# Altium schematic sheet ATMEGA128RF.SchDoc
size A3
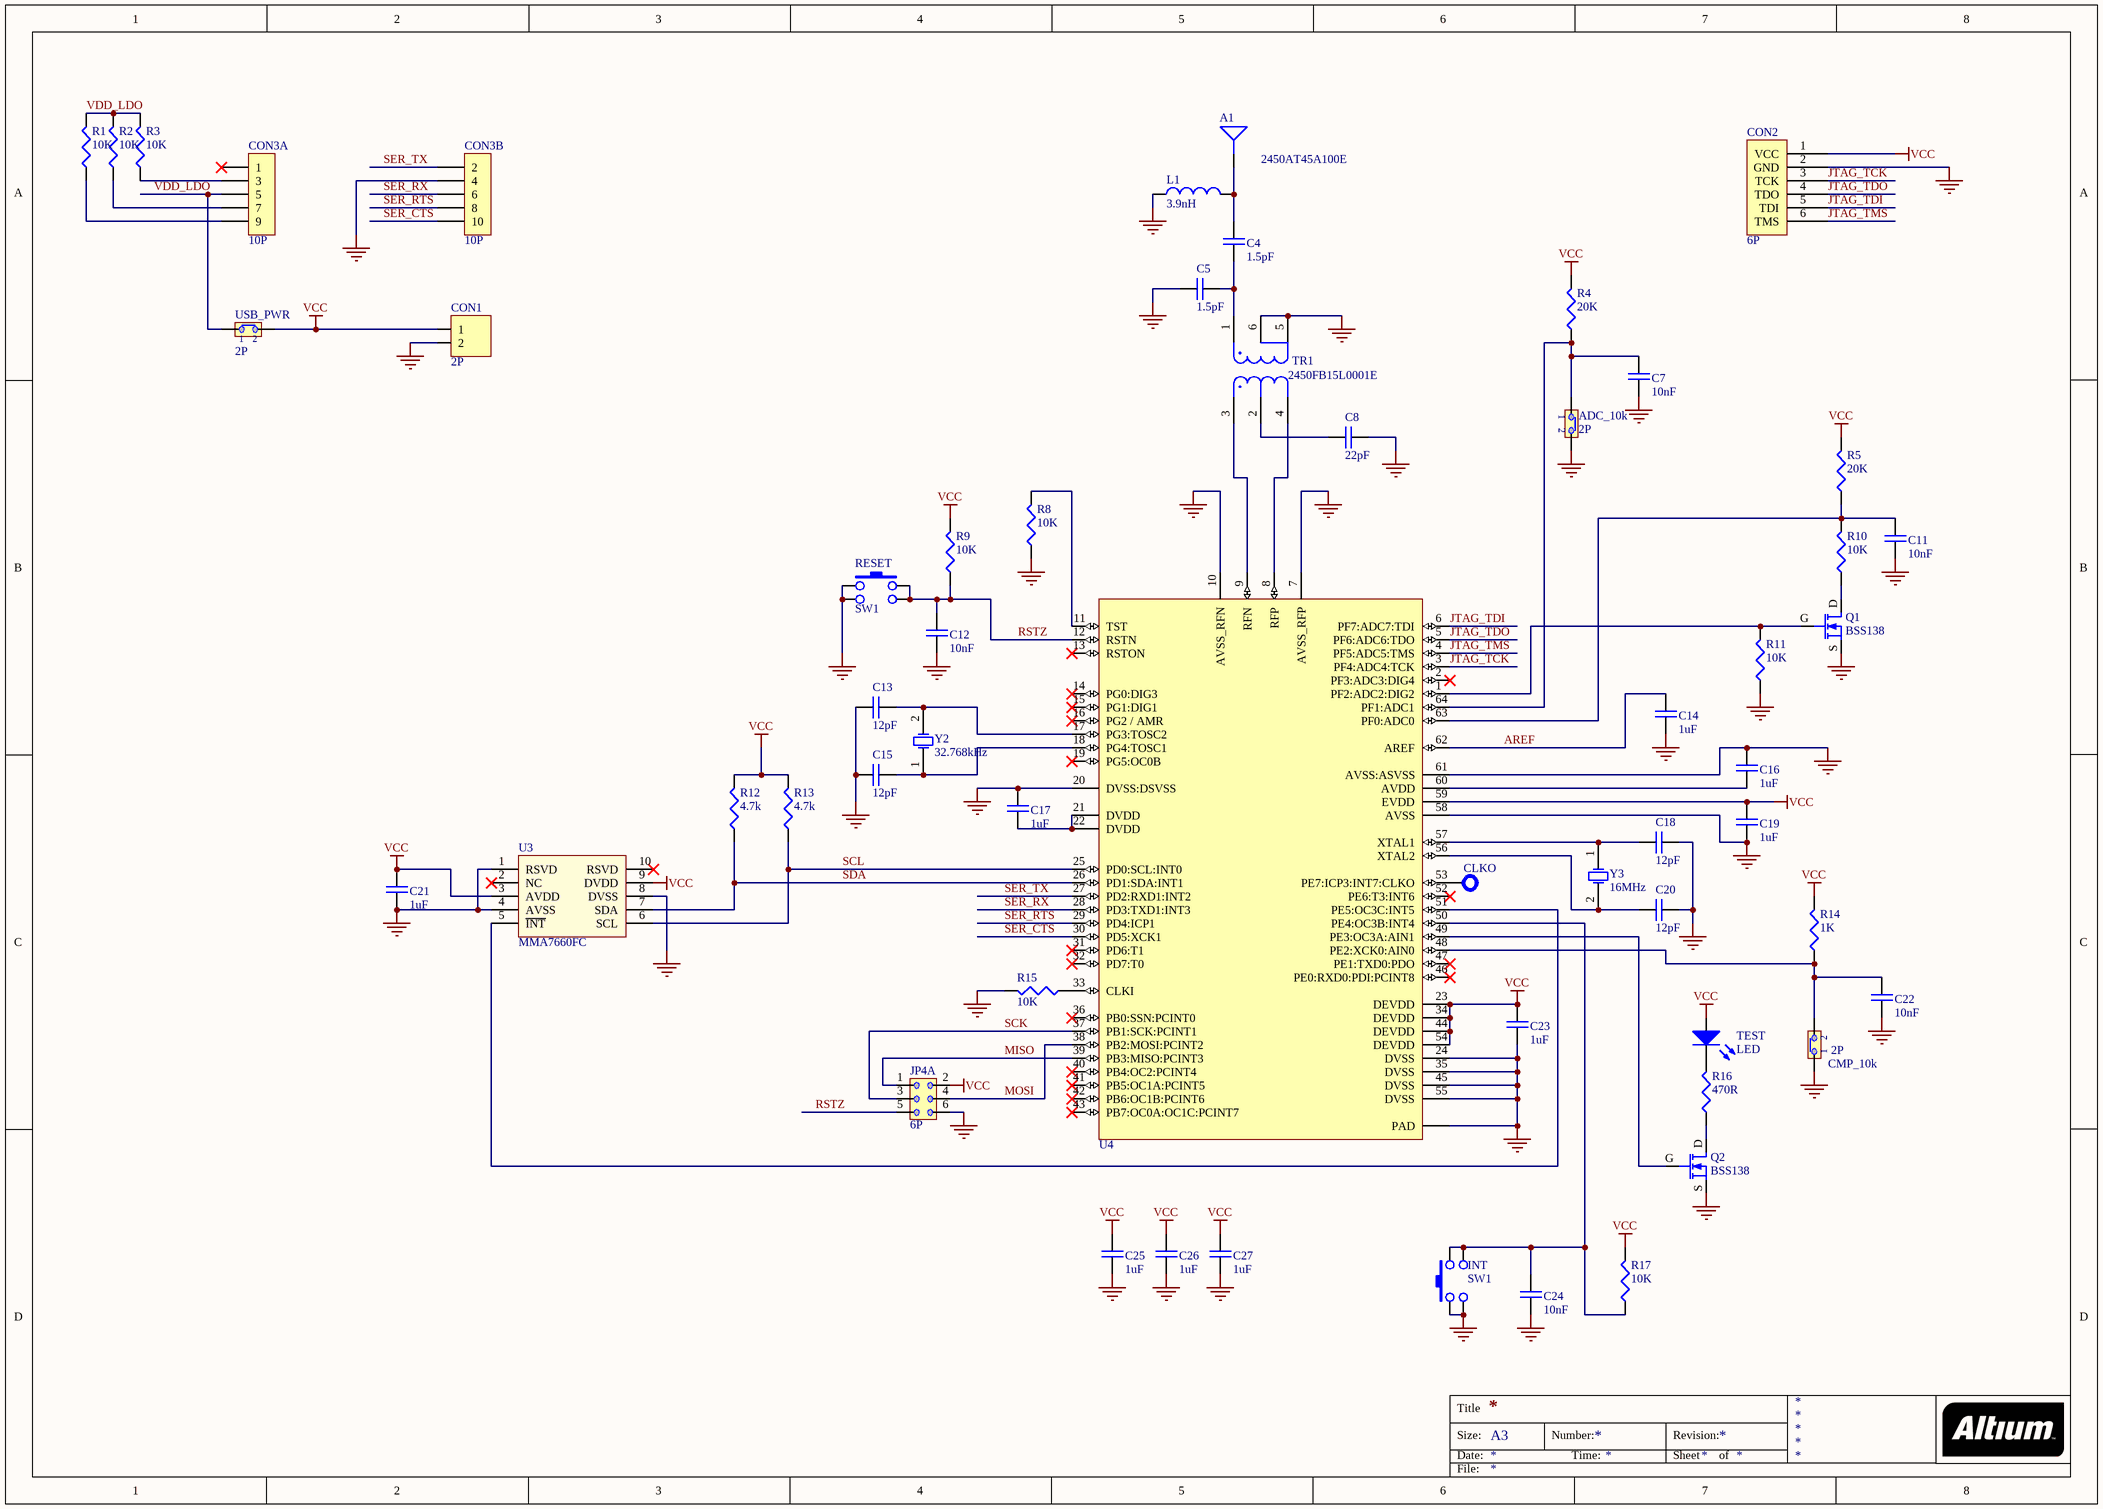
[diagram p0: ATMEGA128RF.SchDoc]

## Parts
A1  2450AT45A100E  [2450AT45A100E]
ADC_10k  2P  [SIP-2]
C4  1.5pF  [0402]
C5  1.5pF  [0402]
C7  10nF  [0603]
C8  22pF  [0402]
C11  10nF  [0603]
C12  10nF  [0603]
C13  12pF  [0603]
C14  1uF  [0603]
C15  12pF  [0603]
C16  1uF  [0603]
C17  1uF  [0603]
C18  12pF  [0603]
C19  1uF  [0603]
C20  12pF  [0603]
C21  1uF  [0603]
C22  10nF  [0603]
C23  1uF  [0603]
C24  10nF  [0603]
C25  1uF  [0603]
C26  1uF  [0603]
C27  1uF  [0603]
CLKO  Test Point  [TERMINAL]  (value not drawn)  (no BOM)
CMP_10k  2P  [SIP-2]
CON1  2P  [INTERLOCK2-5MM]
CON2  6P  [SIP-6-JTAG]
CON3  10P  [IDC-10-90]  (parts A,B of 2)
INT  SW1  [MICROSWITCH]
JP4  6P  [DIL-6]  (part A of 3)
L1  3.9nH  [0402]
Q1  BSS138  [SOT-23@GSD]
Q2  BSS138  [SOT-23@GSD]
R1  10K  [0603]
R2  10K  [0603]
R3  10K  [0603]
R4  20K  [0603]
R5  20K  [0603]
R8  10K  [0603]
R9  10K  [0603]
R10  10K  [0603]
R11  10K  [0603]
R12  4.7k  [0603]
R13  4.7k  [0603]
R14  1K  [0603]
R15  10K  [0603]
R16  470R  [0603]
R17  10K  [0603]
RESET  SW1  [MICROSWITCH]
TEST  LED  [0805@DIODE]
TR1  2450FB15L0001E  [0805@BALUN]
U3  MMA7660FC  [DFN-10]
U4  ATmega128RFA1  [QFN-64@EP]  (value not drawn)
USB_PWR  2P  [SIP-2]
Y2  32.768kHz  [HC-49U]
Y3  16MHz  [HC-49U]

## Nets
GND: ADC_10k.2 C5.1 C7.2 C8.2 C11.1 C12.2 C13.1 C14.1 C15.1 C16.2 C17.2 C18.2 C19.1 C20.2 C21.1 C22.1 C23.1 C24.1 C25.1 C26.1 C27.1 CMP_10k.1 CON1.2 CON2.2(GND) CON3.4 INT.2 INT.4 JP4.6 L1.1 Q1.S Q2.S R8.1 R11.1 R15.2 RESET.1 RESET.3 TR1.5(Ground) TR1.6(Ground) U3.1(RSVD) U3.4(AVSS) U3.8(DVSS) U4.7(AVSS_RFP) U4.10(AVSS_RFN) U4.20(DVSS:DSVSS) U4.24(DVSS) U4.35(DVSS) U4.45(DVSS) U4.55(DVSS) U4.58(AVSS) U4.61(AVSS:ASVSS) U4.PAD
VCC: C19.2 C21.2 C23.2 C25.2 C26.2 C27.2 CON1.1 CON2.1(VCC) JP4.2 R4.2 R5.2 R9.2 R12.2 R13.2 R14.2 R17.2 TEST.A U3.3(AVDD) U3.9(DVDD) U4.23(DEVDD) U4.34(DEVDD) U4.44(DEVDD) U4.54(DEVDD) U4.59(EVDD) USB_PWR.2
AREF: C14.2 U4.62(AREF)
JTAG_TCK: CON2.3(TCK) U4.3(PF4:ADC4:TCK)
JTAG_TDI: CON2.5(TDI) U4.6(PF7:ADC7:TDI)
JTAG_TDO: CON2.4(TDO) U4.5(PF6:ADC6:TDO)
JTAG_TMS: CON2.6(TMS) U4.4(PF5:ADC5:TMS)
MISO: JP4.1 U4.39(PB3:MISO:PCINT3)
MOSI: JP4.4 U4.38(PB2:MOSI:PCINT2)
RSTZ: C12.1 JP4.5 R9.1 RESET.2 RESET.4 U4.12(RSTN)
SCK: JP4.3 U4.37(PB1:SCK:PCINT1)
SCL: R13.1 U3.6(SCL) U4.25(PD0:SCL:INT0)
SDA: R12.1 U3.7(SDA) U4.26(PD1:SDA:INT1)
SER_CTS: CON3.10 U4.30(PD5:XCK1)
SER_RTS: CON3.8 U4.29(PD4:ICP1)
SER_RX: CON3.6 U4.28(PD3:TXD1:INT3)
SER_TX: CON3.2 U4.27(PD2:RXD1:INT2)
VDD_LDO: CON3.5 R1.2 R2.2 R3.2 USB_PWR.1
NetA1_1: A1.1 C4.2 L1.2
NetADC_10k_1: ADC_10k.1 C7.1 R4.1 U4.64(PF1:ADC1)
NetC4_1: C4.1 C5.2 TR1.1(Unbalanced_Port)
NetC8_1: C8.1 TR1.2(DC_Feed_+_RF_GND)
NetC11_2: C11.2 R5.1 R10.2 U4.63(PF0:ADC0)
NetC13_2: C13.2 U4.17(PG3:TOSC2) Y2.2(OSC2)
NetC15_2: C15.2 U4.18(PG4:TOSC1) Y2.1(OSC1)
NetC16_1: C16.1 U4.60(AVDD)
NetC17_1: C17.1 U4.21(DVDD) U4.22(DVDD)
NetC18_1: C18.1 U4.57(XTAL1) Y3.1(OSC1)
NetC20_1: C20.1 U4.56(XTAL2) Y3.2(OSC2)
NetC22_2: C22.2 CMP_10k.2 R14.1 U4.48(PE2:XCK0:AIN0)
NetC24_2: C24.2 INT.1 INT.3 R17.1 U4.50(PE4:OC3B:INT4)
NetCLKO_1: CLKO.1(TP) U4.53(PE7:ICP3:INT7:CLKO)
NetCON3_3: CON3.3 R3.1
NetCON3_7: CON3.7 R2.1
NetCON3_9: CON3.9 R1.1
NetQ1_D: Q1.D R10.1
NetQ1_G: Q1.G R11.2 U4.1(PF2:ADC2:DIG2)
NetQ2_D: Q2.D R16.1
NetQ2_G: Q2.G U4.49(PE3:OC3A:AIN1)
NetR8_2: R8.2 U4.11(TST)
NetR15_1: R15.1 U4.33(CLKI)
NetR16_2: R16.2 TEST.K
NetTR1_3: TR1.3(Balanced_Port) U4.9(RFN)
NetTR1_4: TR1.4(Balanced_Port) U4.8(RFP)
NetU3_5: U3.5(~{INT}) U4.51(PE5:OC3C:INT5)

Not connected (* = marked no-connect by the designer): CON3 1*; U3 2(NC)* 10(RSVD)*; U4 2(PF3:ADC3:DIG4)* 13(RSTON)* 14(PG0:DIG3)* 15(PG1:DIG1)* 16(PG2_/_AMR)* 19(PG5:OC0B)* 31(PD6:T1)* 32(PD7:T0)* 36(PB0:SSN:PCINT0)* 40(PB4:OC2:PCINT4)* 41(PB5:OC1A:PCINT5)* 42(PB6:OC1B:PCINT6)* 43(PB7:OC0A:OC1C:PCINT7)* 46(PE0:RXD0:PDI:PCINT8)* 47(PE1:TXD0:PDO)* 52(PE6:T3:INT6)*

## Notes on the sheet
- Title
- Size:
- Date:
- A3
- Number:
- Time:
- Revision:
- Sheet
- of
- File:

## Library data of the parts
A1 = Antenna SE: ANTENNA
ADC_10k CMP_10k USB_PWR = JMP2: 2-pin Jumper; Owner: Nuno Brum; Sub-Type: Connector; STATE1: 1; Assembly: INS; Validation Date: 2006-05-15; Creation Date: 2002-07-17; Status: Valid; Type: Electrical & Mechanical
C4 C5 C7 C8 C11-C27 = CAP: Capacitor; Owner: Nuno Brum; Sub-Type: Ceramic; Assembly: INS; Maximum Voltage: *; Creation Date: 2005-04-28; Status: Valid; Validation date: 2006-05-15; Type: Capacitor
CLKO = TEST-PROBE: Test/Probe Point; Owner: Nuno Brum; Sub-Type: Mechanical; Assembly: PCB; Validation Date: 2006-05-15; Type: PCB; Creation Date: 2005-06-01; Status: Valid
CON1 = CON02: Connector 2 pins; Owner: Rui Rebelo; Assembly: INS; Sub-Type: Connector; Creation Date: 2005-05-27; Status: Valid; Validation Date: 2006-05-15; Type: Electrical & Mechanical
CON2 = CON-JTAG: Generic JTAG Connector; Owner: António Oliveira; Assembly: INS; Sub-Type: Connector; Creation Date: 2005-11-07; Status: Valid; Validation Date: 2006-05-15; Type: Electrical & Mechanical
CON3 = CON10: Connector 10 Pins; Owner: António Silva; Assembly: INS; Sub-Type: Connector; Creation Date: 2005-11-21; Status: Valid; Validation Date: 2006-05-15; Type: Electrical & Mechanical
INT RESET = SW1: Switch Push Button; Owner: Nuno Brum; Assembly: INS; Validation Date: 2006-05-15; Sub-Type: Switch; Creation Date: 2002-07-17; Status: Valid; Type: Electrical & Mechanical
JP4 = JMP6: 6-Pin Jumper; Sub-Type: Connector; Owner: Rui Rebelo; Assembly: INS; Creation Date: 2005-07-17; Status: Valid; Validation Date: 2006-05-15; Type: Electrical & Mechanical
L1 = IND: Inductor; Owner: Nuno Brum; Sub-Type: Generic; Assembly: INS; Validation date: 2006-05-15; Creation Date: 2002-07-17; Status: Valid; Type: Inductor
Q1 Q2 = MOSFET-N: N-Channel Logic Level Enhancement Mode Field Effect Transistor; pin to pad: 2>3 3>2; Owner: Nuno Brum; Sub-Type: MOSFET; Assembly: INS; Creation Date: 2001-06-05; Status: Valid; Model: BSS138; Type: Transistor
R1-R5 R8-R17 = RES: Resistor; Owner: Nuno Brum; Sub-Type: Generic; Assembly: INS; Validation date: 2006-05-15; Creation Date: 2002-07-17; Status: Valid; Power: *; Type: Resistor
TEST = LED: Light emitting diode; Owner: Nuno Brum; Assembly: INS; Creation Date: 2001-06-05; Sub-Type: LED; Status: Valid; Validation date: 2006-05-15; Model: LED; Type: Diode
TR1 = 2450FB15L0001E: FILTER BALUN ATMEL 2.45GHZ; Owner: Rui Rebelo; Sub-Type: Transformer; Type: Electrical & Mechanical; Assembly: INS; Creation Date: 2002-07-25; Status: New
U3 = MMA7660FC: 3-Axis Orientation/Motion Detection Sensor
U4 = ATmega128RFA1: 802.15.4 compliant AVR transceiver; verified by: vlarsen; verified date: 2010-12-05; Status: Verified
Y2 Y3 = Crystal Oscillator: Published: 17-Jul-2002; DatasheetDocument: 18-Apr-2000; PackageReference: CSM-7; Publisher: Altium Limited; ComponentLink1Description: Manufacturer Link; ComponentLink1URL: http://www.ecsxtal.com/; ComponentLink2Description: Datasheet; ComponentLink2URL: http://www.ecsxtal.com/pdf3/CSM_7.pdf